# Altium project Mars.PrjPcb
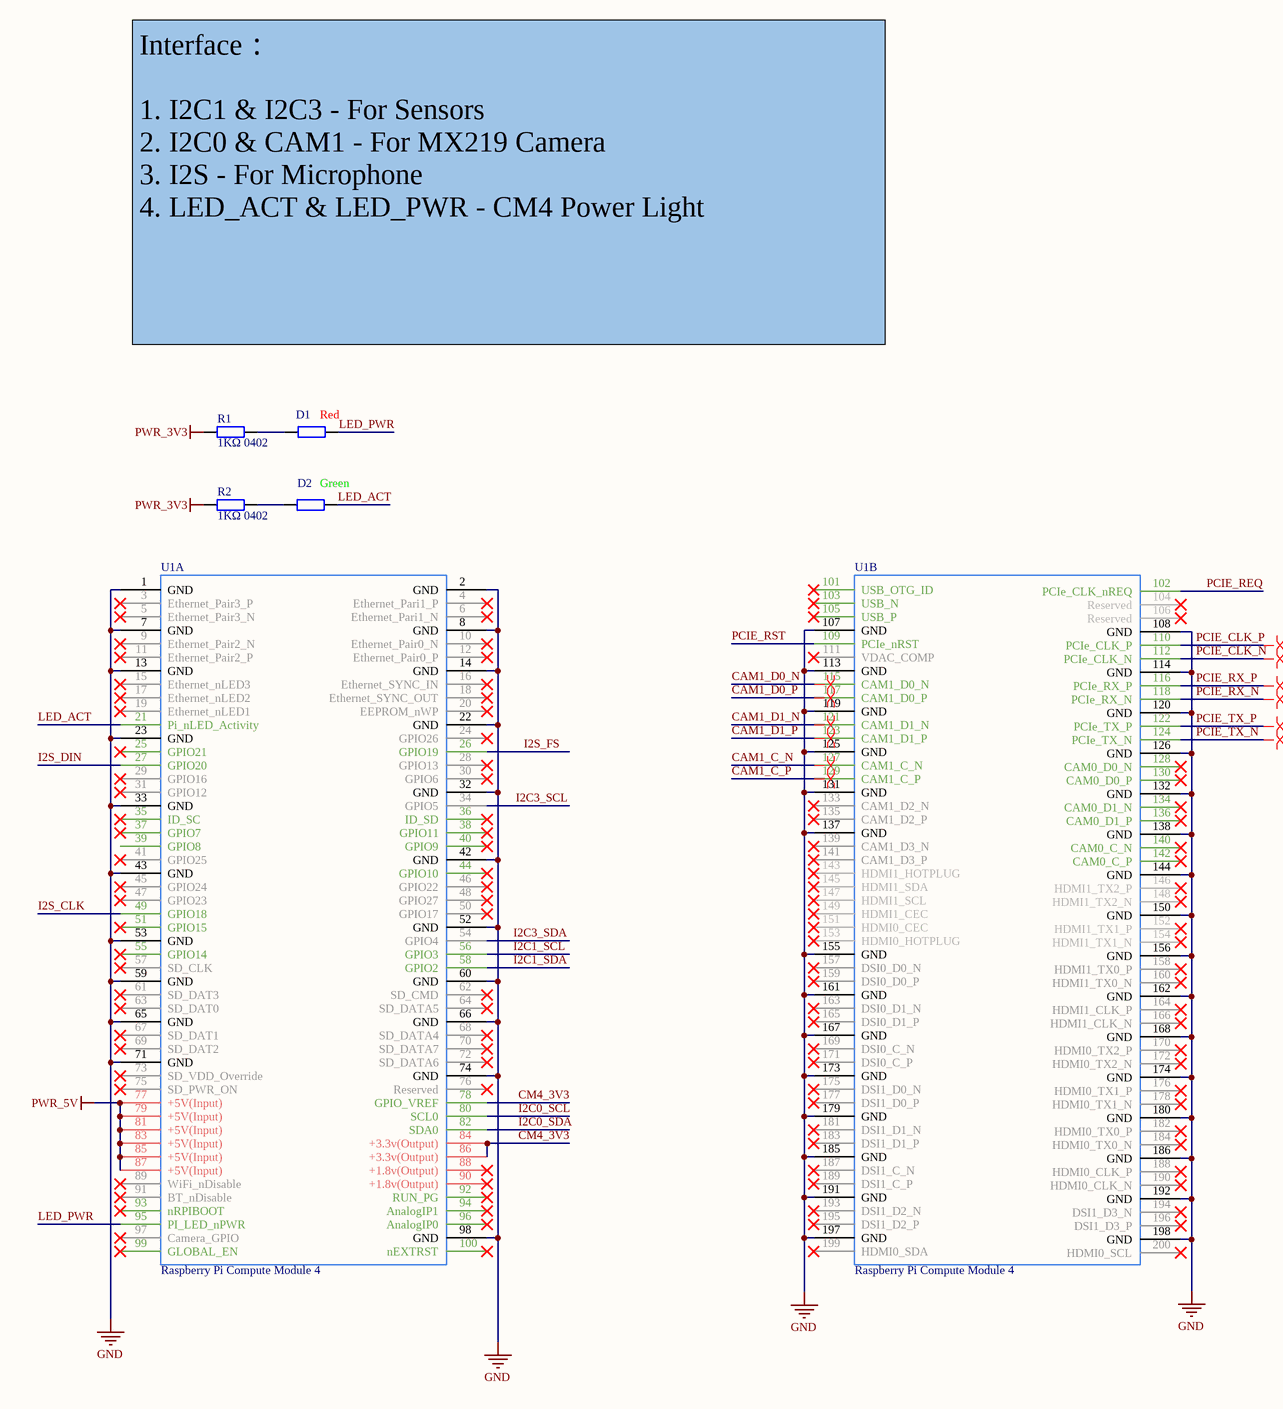
[diagram p0: M1_CM4.SchDoc]
5 sheets, 166 parts. Net scope: global (net labels, ports and power ports of the same name join across sheets).
Board file: M2.PcbDoc
Sheets:
  M1_CM4.SchDoc
  M2_Power.SchDoc
  M3_Coral.SchDoc
  M4_Sensors.SchDoc
  M5_Camera.SchDoc

## Sheet M1_CM4.SchDoc
size A3; SheetNumber: 1; SheetTotal: 5

### Parts
D1  Red  [0402_R]
D2  Green  [0402_R]
R1  1KΩ 0402  [0402_R]
R2  1KΩ 0402  [0402_R]
U1  Raspberry Pi Compute Module 4  [CM4T-DF40HC(3.0)-100DS]  (parts A,B of 2)

### Nets
GND: U1.1(GND) U1.2(GND) U1.7(GND) U1.8(GND) U1.13(GND) U1.14(GND) U1.22(GND) U1.23(GND) U1.32(GND) U1.33(GND) U1.42(GND) U1.43(GND) U1.52(GND) U1.53(GND) U1.59(GND) U1.60(GND) U1.65(GND) U1.66(GND) U1.71(GND) U1.74(GND) U1.98(GND) U1.107(GND) U1.108(GND) U1.113(GND) U1.114(GND) U1.119(GND) U1.120(GND) U1.125(GND) U1.126(GND) U1.131(GND) U1.132(GND) U1.137(GND) U1.138(GND) U1.144(GND) U1.150(GND) U1.155(GND) U1.156(GND) U1.161(GND) U1.162(GND) U1.167(GND) U1.168(GND) U1.173(GND) U1.174(GND) U1.179(GND) U1.180(GND) U1.185(GND) U1.186(GND) U1.191(GND) U1.192(GND) U1.197(GND) U1.198(GND)
PWR_3V3: R1.1 R2.1
PWR_5V: U1.77(+5V(Input)) U1.79(+5V(Input)) U1.81(+5V(Input)) U1.83(+5V(Input)) U1.85(+5V(Input)) U1.87(+5V(Input))
CAM1_C_N: U1.127(CAM1_C_N)
CAM1_C_P: U1.129(CAM1_C_P)
CAM1_D0_N: U1.115(CAM1_D0_N)
CAM1_D0_P: U1.117(CAM1_D0_P)
CAM1_D1_N: U1.121(CAM1_D1_N)
CAM1_D1_P: U1.123(CAM1_D1_P)
CM4_3V3: U1.78(GPIO_VREF) U1.84(+3.3v(Output)) U1.86(+3.3v(Output))
I2C0_SCL: U1.80(SCL0)
I2C0_SDA: U1.82(SDA0)
I2C1_SCL: U1.56(GPIO3)
I2C1_SDA: U1.58(GPIO2)
I2C3_SCL: U1.34(GPIO5)
I2C3_SDA: U1.54(GPIO4)
I2S_CLK: U1.49(GPIO18)
I2S_DIN: U1.27(GPIO20)
I2S_FS: U1.26(GPIO19)
LED_ACT: D2.2 U1.21(Pi_nLED_Activity)
LED_PWR: D1.2 U1.95(PI_LED_nPWR)
PCIE_CLK_N: U1.112(PCIe_CLK_N)
PCIE_CLK_P: U1.110(PCIe_CLK_P)
PCIE_REQ: U1.102(PCIe_CLK_nREQ)
PCIE_RST: U1.109(PCIe_nRST)
PCIE_RX_N: U1.118(PCIe_RX_N)
PCIE_RX_P: U1.116(PCIe_RX_P)
PCIE_TX_N: U1.124(PCIe_TX_N)
PCIE_TX_P: U1.122(PCIe_TX_P)
NetD1_1: D1.1 R1.2
NetD2_1: D2.1 R2.2

Not connected (* = marked no-connect by the designer): U1 3(Ethernet_Pair3_P)* 4(Ethernet_Pari1_P)* 5(Ethernet_Pair3_N)* 6(Ethernet_Pari1_N)* 9(Ethernet_Pair2_N)* 10(Ethernet_Pair0_N)* 11(Ethernet_Pair2_P)* 12(Ethernet_Pair0_P)* 15(Ethernet_nLED3)* 16(Ethernet_SYNC_IN)* 17(Ethernet_nLED2)* 18(Ethernet_SYNC_OUT)* 19(Ethernet_nLED1)* 20(EEPROM_nWP)* 24(GPIO26)* 25(GPIO21)* 28(GPIO13)* 29(GPIO16)* 30(GPIO6)* 31(GPIO12)* 35(ID_SC)* 36(ID_SD)* 37(GPIO7)* 38(GPIO11)* 39(GPIO8) 40(GPIO9)* 41(GPIO25)* 44(GPIO10)* 45(GPIO24)* 46(GPIO22)* 47(GPIO23)* 48(GPIO27)* 50(GPIO17)* 51(GPIO15)* 55(GPIO14)* 57(SD_CLK)* 61(SD_DAT3)* 62(SD_CMD)* 63(SD_DAT0)* 64(SD_DATA5)* 67(SD_DAT1)* 68(SD_DATA4)* 69(SD_DAT2)* 70(SD_DATA7)* 72(SD_DATA6)* 73(SD_VDD_Override)* 75(SD_PWR_ON)* 76(Reserved)* 88(+1.8v(Output))* 89(WiFi_nDisable)* 90(+1.8v(Output))* 91(BT_nDisable)* 92(RUN_PG)* 93(nRPIBOOT)* 94(AnalogIP1)* 96(AnalogIP0)* 97(Camera_GPIO)* 99(GLOBAL_EN)* 100(nEXTRST)* 101(USB_OTG_ID)* 103(USB_N)* 104(Reserved)* 105(USB_P)* 106(Reserved)* 111(VDAC_COMP)* 128(CAM0_D0_N)* 130(CAM0_D0_P)* 133(CAM1_D2_N)* 134(CAM0_D1_N)* 135(CAM1_D2_P)* 136(CAM0_D1_P)* 139(CAM1_D3_N)* 140(CAM0_C_N)* 141(CAM1_D3_P)* 142(CAM0_C_P)* 143(HDMI1_HOTPLUG)* 145(HDMI1_SDA)* 146(HDMI1_TX2_P)* 147(HDMI1_SCL)* 148(HDMI1_TX2_N)* 149(HDMI1_CEC)* 151(HDMI0_CEC)* 152(HDMI1_TX1_P)* 153(HDMI0_HOTPLUG)* 154(HDMI1_TX1_N)* 157(DSI0_D0_N)* 158(HDMI1_TX0_P)* 159(DSI0_D0_P)* 160(HDMI1_TX0_N)* 163(DSI0_D1_N)* 164(HDMI1_CLK_P)* 165(DSI0_D1_P)* 166(HDMI1_CLK_N)* 169(DSI0_C_N)* 170(HDMI0_TX2_P)* 171(DSI0_C_P)* 172(HDMI0_TX2_N)* 175(DSI1_D0_N)* 176(HDMI0_TX1_P)* 177(DSI1_D0_P)* 178(HDMI0_TX1_N)* 181(DSI1_D1_N)* 182(HDMI0_TX0_P)* 183(DSI1_D1_P)* 184(HDMI0_TX0_N)* 187(DSI1_C_N)* 188(HDMI0_CLK_P)* 189(DSI1_C_P)* 190(HDMI0_CLK_N)* 193(DSI1_D2_N)* 194(DSI1_D3_N)* 195(DSI1_D2_P)* 196(DSI1_D3_P)* 199(HDMI0_SDA)* 200(HDMI0_SCL)*

### Layout directives
differential pair: CAM1_C_N, CAM1_C_P, CAM1_D0_N, CAM1_D0_P, CAM1_D1_N, CAM1_D1_P, PCIE_CLK_N, PCIE_CLK_P, PCIE_RX_N, PCIE_RX_P, PCIE_TX_N, PCIE_TX_P

### Notes on the sheet
- Interface：
  1. I2C1 & I2C3 - For Sensors
  2. I2C0 & CAM1 - For MX219 Camera
  3. I2S - For Microphone
  4. LED_ACT & LED_PWR - CM4 Power Light

### Library data of the parts
D1 D2 = 0402 10KΩ (1002) 1%: 贴片电阻; ComponentLink1Description: 供应商链接; ComponentLink1URL: http://www.szlcsc.com/product/details_26487.html; Package: 0402; Supplier: LC; SuppliersPartNumber: C25744
R1 R2 = 0402 1KΩ (1001) 1%: 贴片电阻; ComponentLink1Description: 供应商链接; ComponentLink1URL: http://www.szlcsc.com/product/details_12256.html; Package: 0402; Supplier: LC; SuppliersPartNumber: C11702
U1 = CM4

## Sheet M2_Power.SchDoc
size A3; SheetNumber: 2; SheetTotal: 5
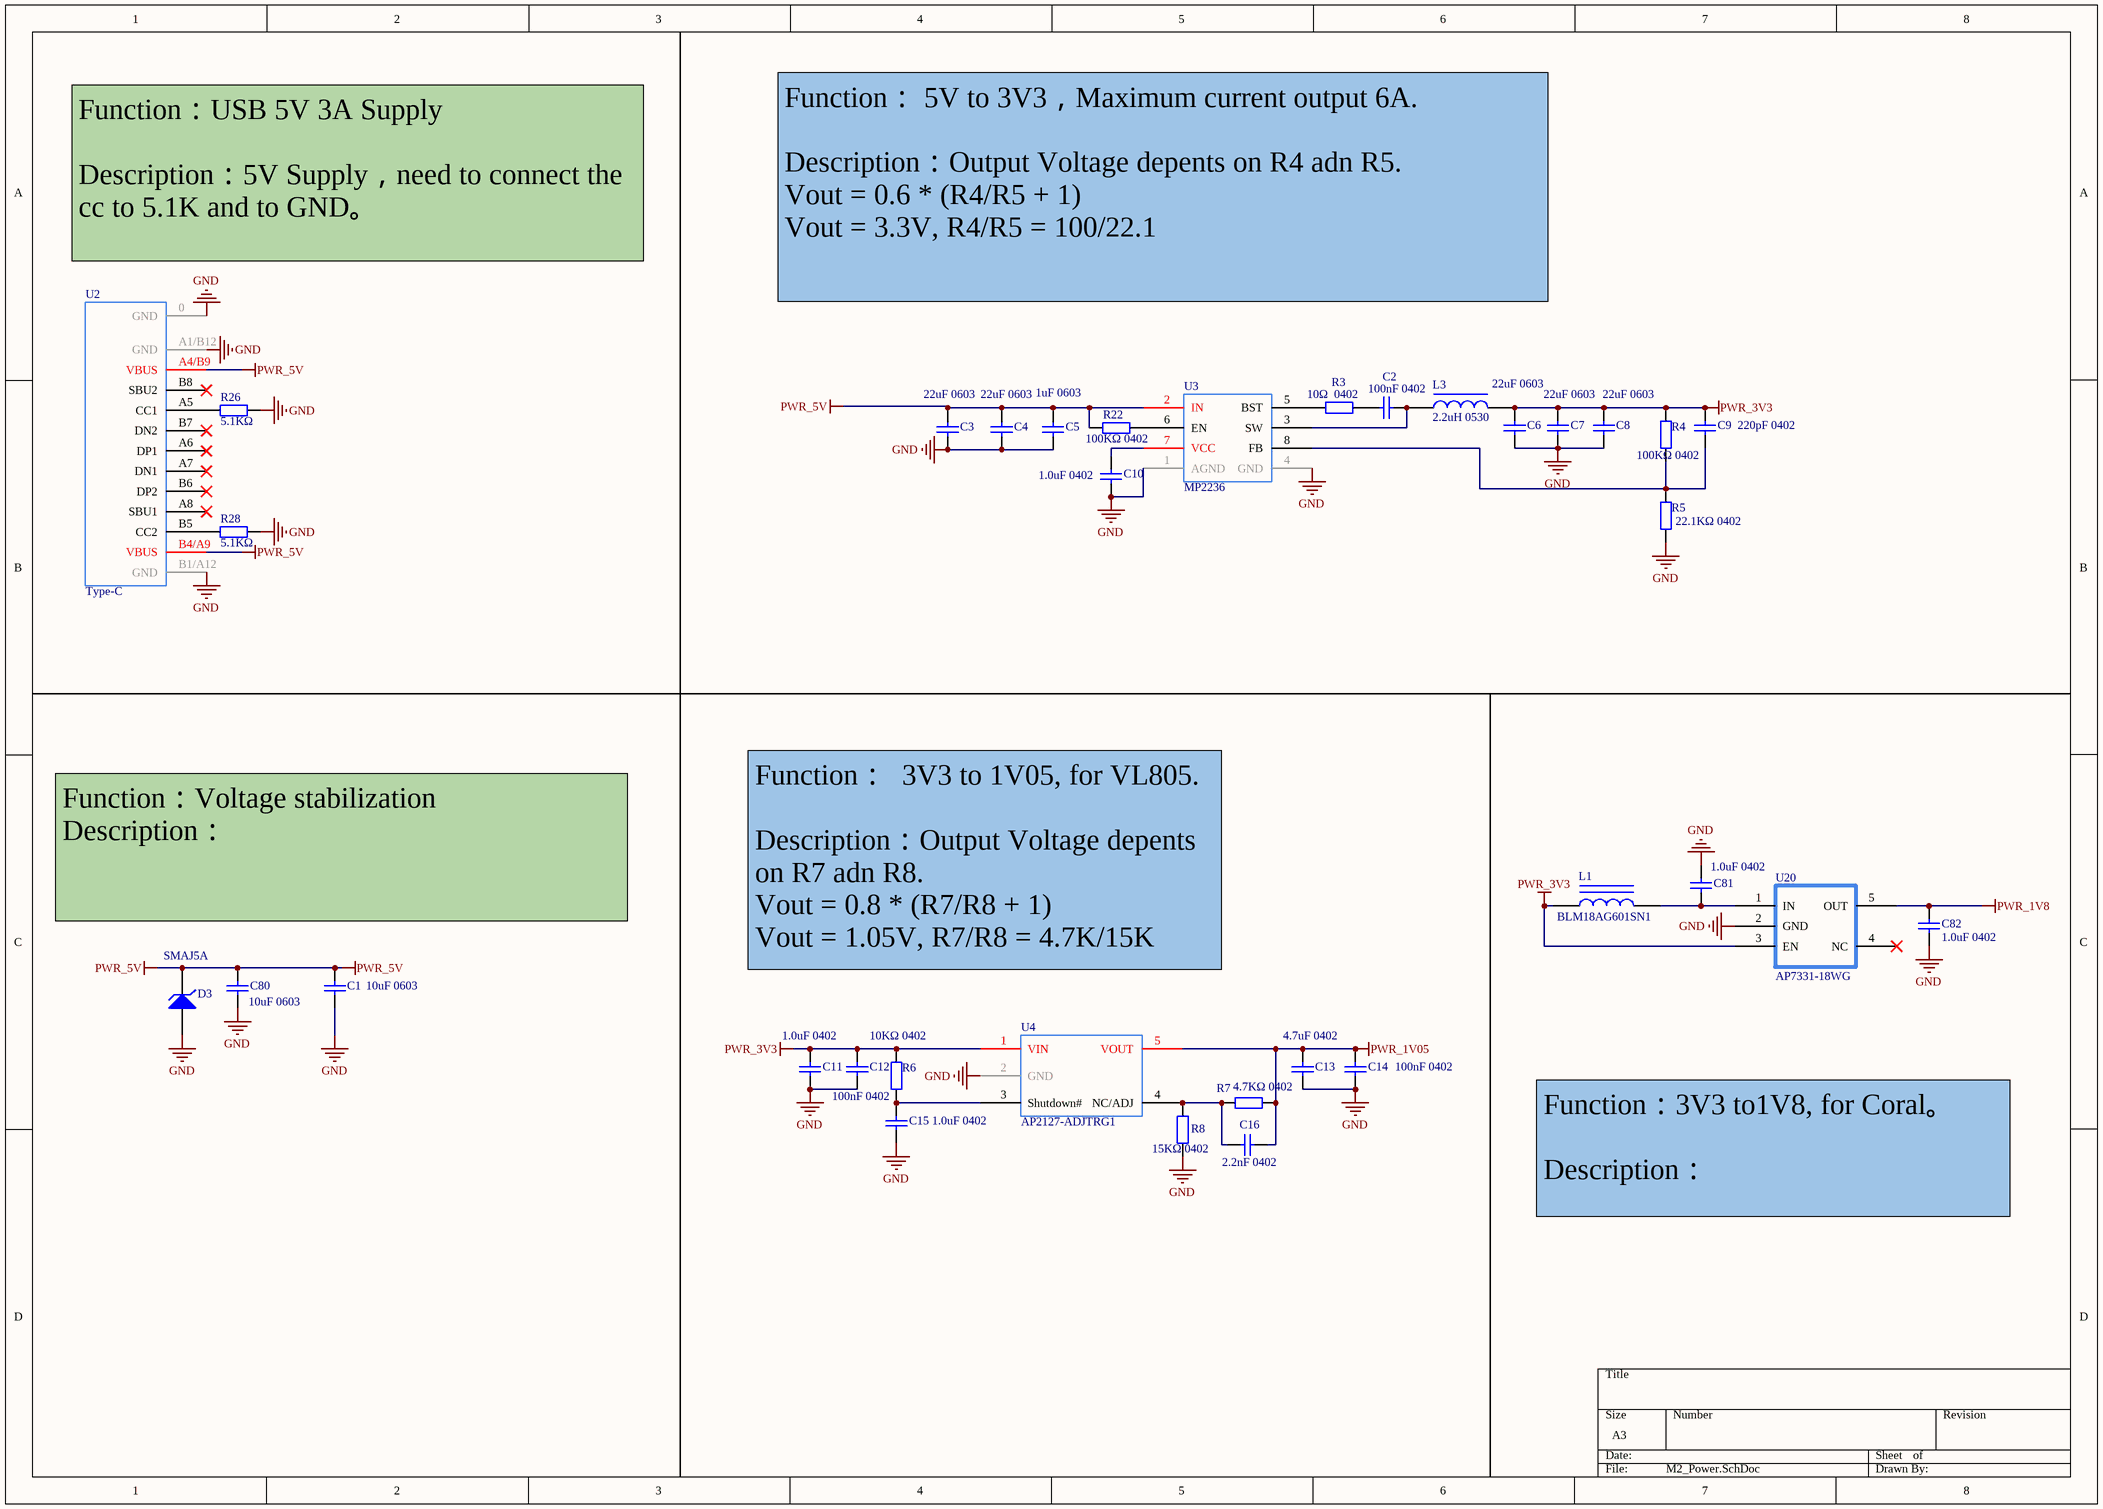
[diagram p1: M2_Power.SchDoc]

### Parts
C1  10uF 0603  [0603_C]
C2  100nF 0402  [0402_C]
C3  22uF 0603  [0603_C]
C4  22uF 0603  [0603_C]
C5  1uF 0603  [0603_C]
C6  22uF 0603  [0603_C]
C7  22uF 0603  [0603_C]
C8  22uF 0603  [0603_C]
C9  220pF 0402  [0402_C]
C10  1.0uF 0402  [0402_C]
C11  1.0uF 0402  [0402_C]
C12  100nF 0402  [0402_C]
C13  4.7uF 0402  [0402_C]
C14  100nF 0402  [0402_C]
C15  1.0uF 0402  [0402_C]
C16  2.2nF 0402  [0402_C]
C80  10uF 0603  [0603_C]
C81  1.0uF 0402  [0402_C]
C82  1.0uF 0402  [0402_C]
D3  SMAJ5A  [SMAJ5A]
L1  BLM18AG601SN1  [0603_L]
L3  2.2uH 0530  [0530]
R3  10Ω  0402  [0402_R]
R4  100KΩ 0402  [0402_R]
R5  22.1KΩ 0402  [0402_R]
R6  10KΩ 0402  [0402_R]
R7  4.7KΩ 0402  [0402_R]
R8  15KΩ 0402  [0402_R]
R22  100KΩ 0402  [0402_R]
R26  5.1KΩ  [0402_R]
R28  5.1KΩ  [0402_R]
U2  Type-C  [Type-C-16P]
U3  MP2236  [MP2236]
U4  AP2127-ADJTRG1  [AP2127K]
U20  AP7331-18WG  [AP7331-18WG]

### Nets
GND: C1.1 C3.1 C4.1 C5.1 C6.1 C7.1 C8.1 C10.1 C11.1 C12.1 C13.1 C14.1 C15.1 C80.1 C81.1 C82.1 D3.1(A) R5.1 R8.1 R26.2 R28.2 U2.0(GND) U2.A1/B12(GND) U2.B1/A12(GND) U3.1(AGND) U3.4(GND) U4.2(GND) U20.2(GND)
PWR_1V05: C13.2 C14.2 C16.2 R7.2 U4.5(VOUT)
PWR_1V8: C82.2 U20.5(OUT)
PWR_3V3: C6.2 C7.2 C8.2 C9.2 C11.2 C12.2 L1.1 L3.2 R4.2 R6.2 U4.1(VIN) U20.3(EN)
PWR_5V: C1.2 C3.2 C4.2 C5.2 C80.2 D3.2(C) R22.1 U2.A4/B9(VBUS) U2.B4/A9(VBUS) U3.2(IN)
NetC2_1: C2.1 R3.2
NetC2_2: C2.2 L3.1 U3.3(SW)
NetC9_1: C9.1 R4.1 R5.2 U3.8(FB)
NetC10_2: C10.2 U3.7(VCC)
NetC15_2: C15.2 R6.1 U4.3(Shutdown#)
NetC16_1: C16.1 R7.1 R8.2 U4.4(NC/ADJ)
NetC81_2: C81.2 L1.2 U20.1(IN)
NetR3_1: R3.1 U3.5(BST)
NetR22_2: R22.2 U3.6(EN)
NetR26_1: R26.1 U2.A5(CC1)
NetR28_1: R28.1 U2.B5(CC2)

Not connected (* = marked no-connect by the designer): U2 A6(DP1)* A7(DN1)* A8(SBU1)* B6(DP2)* B7(DN2)* B8(SBU2)*; U20 4(NC)*

### Notes on the sheet
- Function：USB 5V 3A Supply
  Description：5V Supply，need to connect the cc to 5.1K and to GND。
- Function： 5V to 3V3，Maximum current output 6A.
  Description：Output Voltage depents on R4 adn R5.
  Vout = 0.6 * (R4/R5 + 1)
  Vout = 3.3V, R4/R5 = 100/22.1
- Function：Voltage stabilization
  Description：
- Function：  3V3 to 1V05, for VL805.
  Description：Output Voltage depents on R7 adn R8.
  Vout = 0.8 * (R7/R8 + 1)
  Vout = 1.05V, R7/R8 = 4.7K/15K
- Function：3V3 to1V8, for Coral。
  Description：

### Library data of the parts
C1 C80 = 0603 10uF (106) 10% 10V: 贴片电容; ComponentLink1Description: 供应商链接; ComponentLink1URL: http://www.szlcsc.com/product/details_20411.html; Package: 0603; Supplier: LC; SuppliersPartNumber: C19702
C2 C12 C14 = 0402 100nF (104) 10% 16V: 贴片电容; ComponentLink1Description: 供应商链接; ComponentLink1URL: http://www.szlcsc.com/product/details_1877.html; Package: 0402; Supplier: LC; SuppliersPartNumber: C1525
C3 C4 C6-C8 = 0603 22uF (226) 20% 6.3V: 贴片电容; ComponentLink1Description: 供应商链接; ComponentLink1URL: http://www.szlcsc.com/product/details_60514.html; Package: 0603; Supplier: LC; SuppliersPartNumber: C59461
C5 = 0603 1uF (105) 10% 50V: 贴片电容; ComponentLink1Description: 供应商链接; ComponentLink1URL: http://www.szlcsc.com/product/details_16531.html; Package: 0603; Supplier: LC; SuppliersPartNumber: C15849
C9 = 0402 220pF (221) 10% 50V: 贴片电容; ComponentLink1Description: 供应商链接; ComponentLink1URL: http://www.szlcsc.com/product/details_1882.html; Package: 0402; Supplier: LC; SuppliersPartNumber: C1530
C10 C11 C15 C81 C82 = 0402 1.0uF (105) 10% 25V: 贴片电容; ComponentLink1Description: 供应商链接; ComponentLink1URL: http://www.szlcsc.com/product/details_53938.html; Package: 0402; Supplier: LC; SuppliersPartNumber: C52923
C13 = 0402 4.7uF (475) 20% 10V: 贴片电容; ComponentLink1Description: 供应商链接; ComponentLink1URL: http://www.szlcsc.com/product/details_24469.html; Package: 0402; Supplier: LC; SuppliersPartNumber: C23733
C16 = 0402 2.2nF (222) 10% 50V: 贴片电容; ComponentLink1Description: 供应商链接; ComponentLink1URL: http://www.szlcsc.com/product/details_1883.html; Package: 0402; Supplier: LC; SuppliersPartNumber: C1531
D3 = SMAJ5A: TVS
L1 = 0603 10uH 10%: 贴片电感; ComponentLink1Description: 供应商链接; ComponentLink1URL: http://www.szlcsc.com/product/details_1387.html; Package: 0603; Supplier: LC; SuppliersPartNumber: C1035
L3 = 2.2uH: 2.2uH 0630
R3 = 0402 10Ω (10R0) 1%: 贴片电阻; ComponentLink1Description: 供应商链接; ComponentLink1URL: http://www.szlcsc.com/product/details_25820.html; Package: 0402; Supplier: LC; SuppliersPartNumber: C25077
R4 R22 = 0402 100KΩ (1003) 1%: 贴片电阻; ComponentLink1Description: 供应商链接; ComponentLink1URL: http://www.szlcsc.com/product/details_26484.html; Package: 0402; Supplier: LC; SuppliersPartNumber: C25741
R5 R6 = 0402 10KΩ (1002) 1%: 贴片电阻; ComponentLink1Description: 供应商链接; ComponentLink1URL: http://www.szlcsc.com/product/details_26487.html; Package: 0402; Supplier: LC; SuppliersPartNumber: C25744
R7 = 0402 4.7KΩ (4701) 1%: 贴片电阻; ComponentLink1Description: 供应商链接; ComponentLink1URL: http://www.szlcsc.com/product/details_26643.html; Package: 0402; Supplier: LC; SuppliersPartNumber: C25900
R8 = 0402 15KΩ (1502) 1%: 贴片电阻; ComponentLink1Description: 供应商链接; ComponentLink1URL: http://www.szlcsc.com/product/details_26499.html; Package: 0402; Supplier: LC; SuppliersPartNumber: C25756
R26 R28 = 0402 5.1KΩ (5101) 1%: 贴片电阻; ComponentLink1Description: 供应商链接; ComponentLink1URL: http://www.szlcsc.com/product/details_26648.html; Package: 0402; Supplier: LC; SuppliersPartNumber: C25905
U2 = Type-C-16P
U3 = MP2236: Vin=18, Iout=6A
U4 = AP2127-ADJTRG1: 3.3V-1.05V
U20 = AP7331-18WG: Camera 1.8V

## Sheet M3_Coral.SchDoc
size A3; SheetNumber: 3; SheetTotal: 5
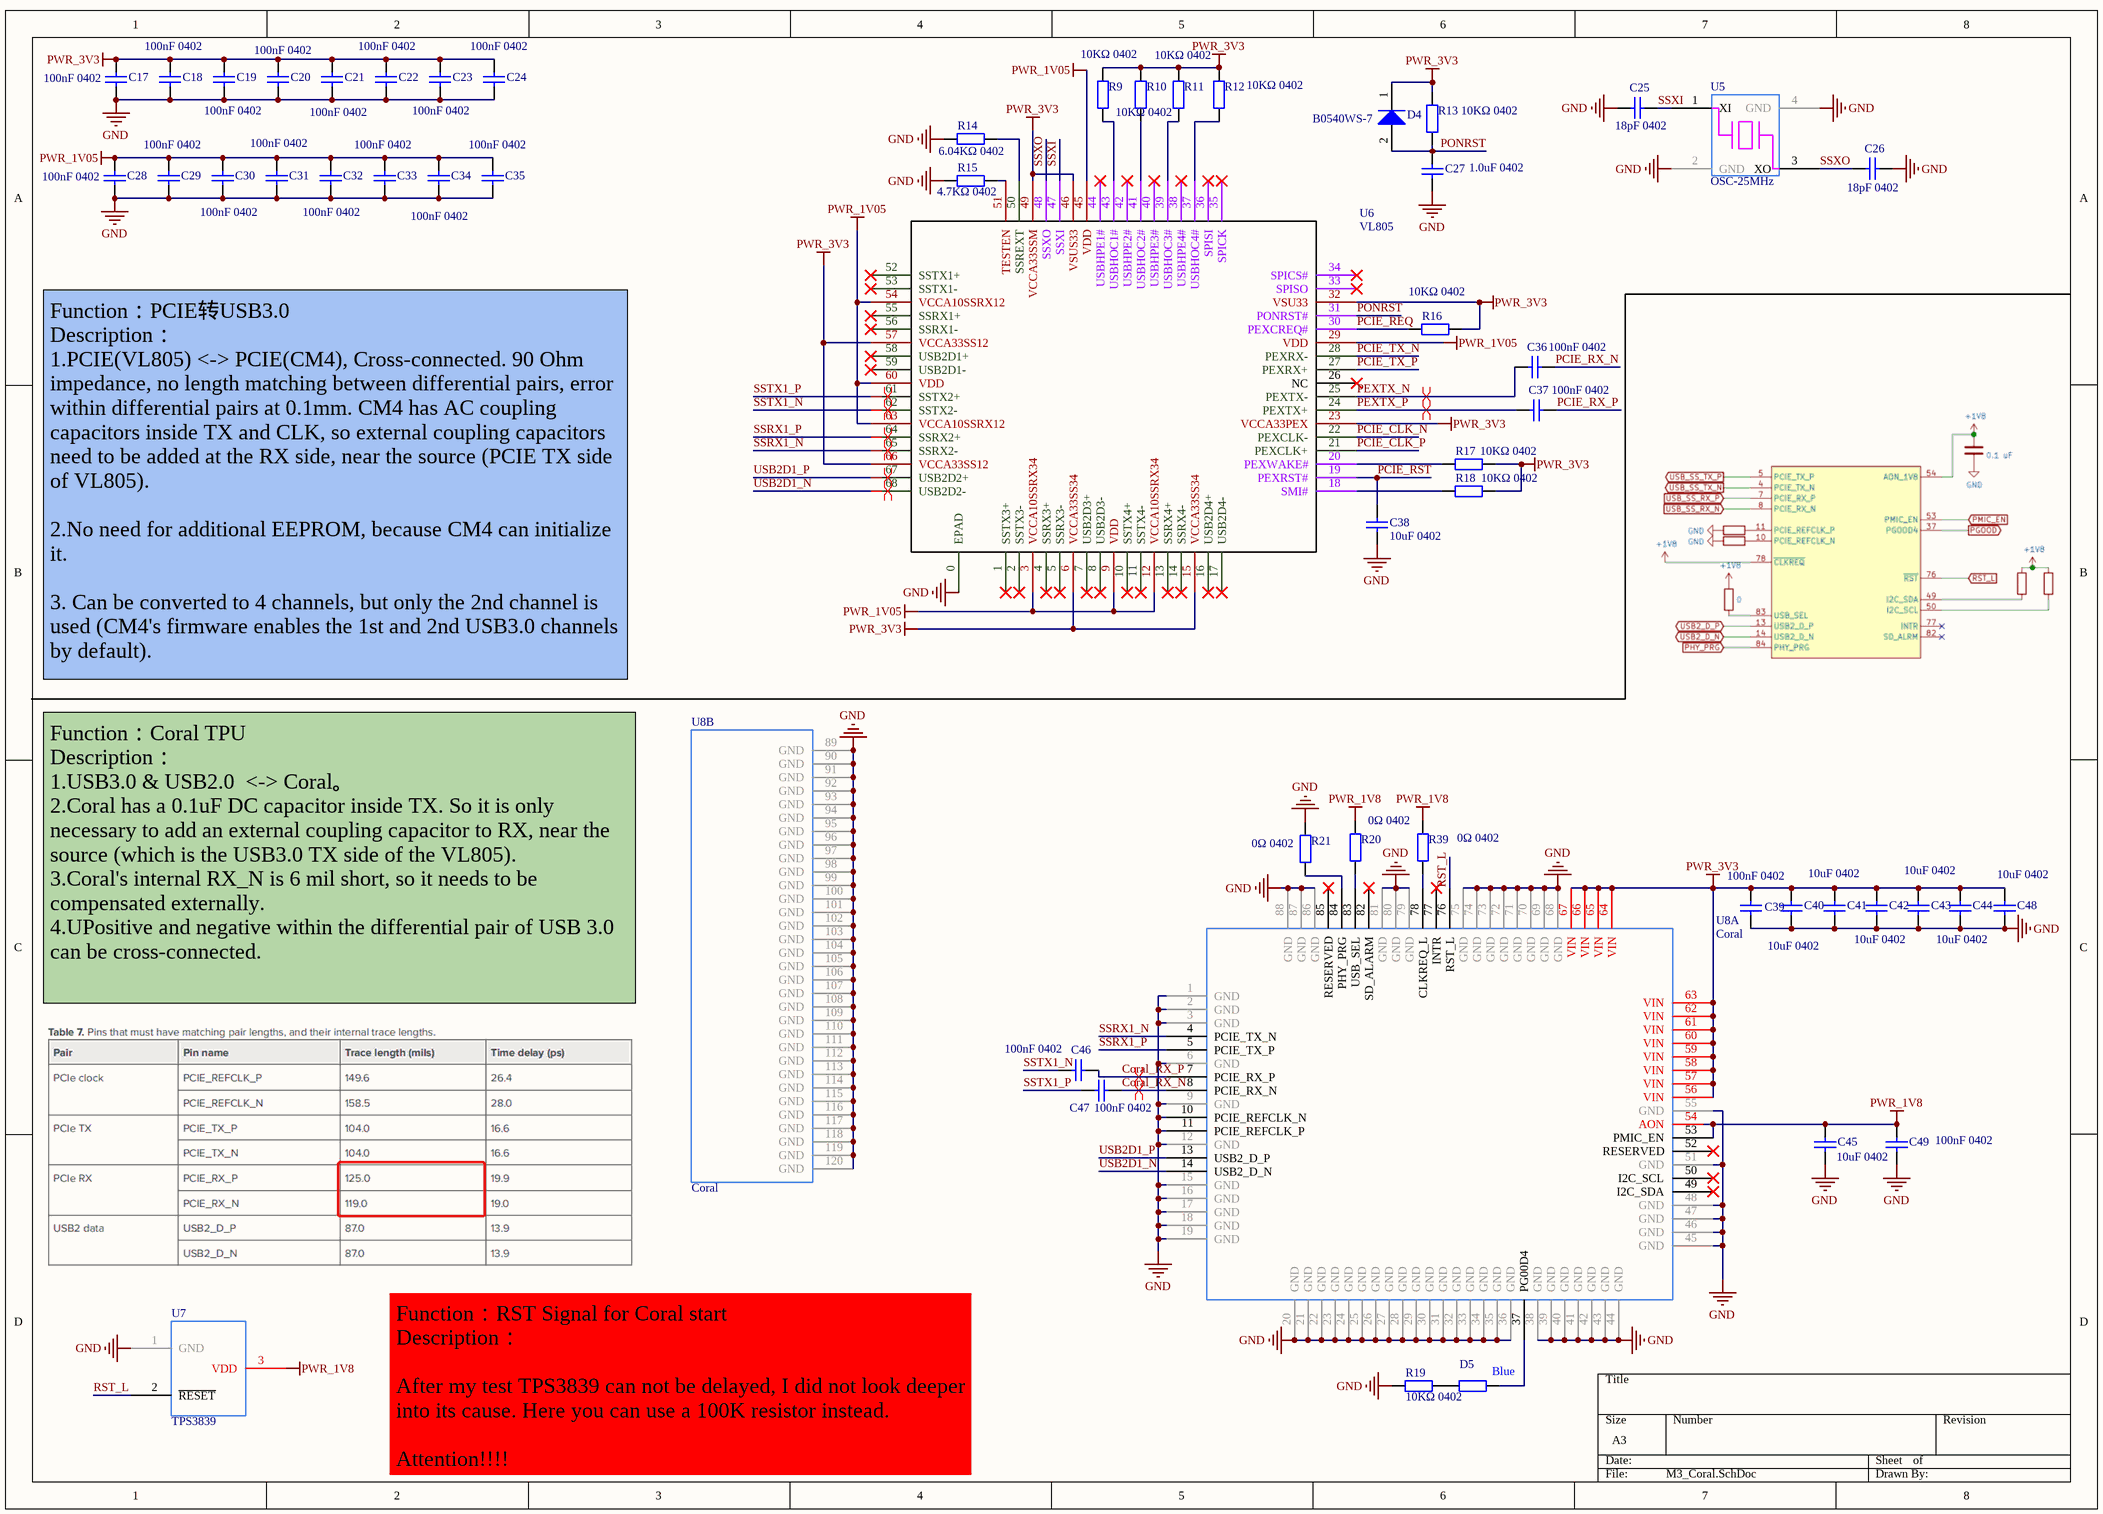
[diagram p2: M3_Coral.SchDoc]

### Parts
C17  100nF 0402  [0402_C]
C18  100nF 0402  [0402_C]
C19  100nF 0402  [0402_C]
C20  100nF 0402  [0402_C]
C21  100nF 0402  [0402_C]
C22  100nF 0402  [0402_C]
C23  100nF 0402  [0402_C]
C24  100nF 0402  [0402_C]
C25  18pF 0402  [0402_C]
C26  18pF 0402  [0402_C]
C27  1.0uF 0402  [0402_C]
C28  100nF 0402  [0402_C]
C29  100nF 0402  [0402_C]
C30  100nF 0402  [0402_C]
C31  100nF 0402  [0402_C]
C32  100nF 0402  [0402_C]
C33  100nF 0402  [0402_C]
C34  100nF 0402  [0402_C]
C35  100nF 0402  [0402_C]
C36  100nF 0402  [0402_C]
C37  100nF 0402  [0402_C]
C38  10uF 0402  [0402_C]
C39  100nF 0402  [0402_C]
C40  10uF 0402  [0402_C]
C41  10uF 0402  [0402_C]
C42  10uF 0402  [0402_C]
C43  10uF 0402  [0402_C]
C44  10uF 0402  [0402_C]
C45  10uF 0402  [0402_C]
C46  100nF 0402  [0402_C]
C47  100nF 0402  [0402_C]
C48  10uF 0402  [0402_C]
C49  100nF 0402  [0402_C]
D4  B0540WS-7  [B0540WS-7]
D5  Blue  [0402_R]
R9  10KΩ 0402  [0402_R]
R10  10KΩ 0402  [0402_R]
R11  10KΩ 0402  [0402_R]
R12  10KΩ 0402  [0402_R]
R13  10KΩ 0402  [0402_R]
R14  6.04KΩ 0402  [0402_R]
R15  4.7KΩ 0402  [0402_R]
R16  10KΩ 0402  [0402_R]
R17  10KΩ 0402  [0402_R]
R18  10KΩ 0402  [0402_R]
R19  10KΩ 0402  [0402_R]
R20  0Ω 0402  [0402_R]
R21  0Ω 0402  [0402_R]
R39  0Ω 0402  [0402_R]
U5  OSC-25MHz  [OSC-25MHz]
U6  VL805  [VL805]
U7  TPS3839  [TPS3839]
U8  Coral  [Coral]  (parts A,B of 2)

### Nets
GND: C17.1 C18.1 C19.1 C20.1 C21.1 C22.1 C23.1 C24.1 C25.1 C26.2 C27.2 C28.1 C29.1 C30.1 C31.1 C32.1 C33.1 C34.1 C35.1 C38.1 C39.1 C40.1 C41.1 C42.1 C43.1 C44.1 C45.1 C48.1 C49.1 R14.2 R15.2 R19.1 R21.2 U5.2(GND) U5.4(GND) U6.0(EPAD) U7.1(GND) U8.1(GND) U8.2(GND) U8.3(GND) U8.6(GND) U8.9(GND) U8.10(PCIE_REFCLK_N) U8.11(PCIE_REFCLK_P) U8.12(GND) U8.15(GND) U8.16(GND) U8.17(GND) U8.18(GND) U8.19(GND) U8.20(GND) U8.21(GND) U8.22(GND) U8.23(GND) U8.24(GND) U8.25(GND) U8.26(GND) U8.27(GND) U8.28(GND) U8.29(GND) U8.30(GND) U8.31(GND) U8.32(GND) U8.33(GND) U8.34(GND) U8.35(GND) U8.36(GND) U8.38(GND) U8.39(GND) U8.40(GND) U8.41(GND) U8.42(GND) U8.43(GND) U8.44(GND) U8.45(GND) U8.46(GND) U8.47(GND) U8.48(GND) U8.51(GND) U8.55(GND) U8.68(GND) U8.69(GND) U8.70(GND) U8.71(GND) U8.72(GND) U8.73(GND) U8.74(GND) U8.75(GND) U8.79(GND) U8.80(GND) U8.81(GND) U8.86(GND) U8.87(GND) U8.88(GND) U8.89(GND) U8.90(GND) U8.91(GND) U8.92(GND) U8.93(GND) U8.94(GND) U8.95(GND) U8.96(GND) U8.97(GND) U8.98(GND) U8.99(GND) U8.100(GND) U8.101(GND) U8.102(GND) U8.103(GND) U8.104(GND) U8.105(GND) U8.106(GND) U8.107(GND) U8.108(GND) U8.109(GND) U8.110(GND) U8.111(GND) U8.112(GND) U8.113(GND) U8.114(GND) U8.115(GND) U8.116(GND) U8.117(GND) U8.118(GND) U8.119(GND) U8.120(GND)
PWR_1V05: C28.2 C29.2 C30.2 C31.2 C32.2 C33.2 C34.2 C35.2 U6.3(VCCA10SSRX34) U6.9(VDD) U6.12(VCCA10SSRX34) U6.29(VDD) U6.45(VDD) U6.54(VCCA10SSRX12) U6.60(VDD) U6.63(VCCA10SSRX12)
PWR_1V8: C45.2 C49.2 R20.2 R39.2 U7.3(VDD) U8.53(PMIC_EN) U8.54(AON)
PWR_3V3: C17.2 C18.2 C19.2 C20.2 C21.2 C22.2 C23.2 C24.2 C39.2 C40.2 C41.2 C42.2 C43.2 C44.2 C48.2 D4.1(K) R9.2 R10.2 R11.2 R12.2 R13.2 R16.2 R17.2 R18.2 U6.6(VCCA33SS34) U6.15(VCCA33SS34) U6.23(VCCA33PEX) U6.32(VSU33) U6.46(VSUS33) U6.49(VCCA33SSM) U6.57(VCCA33SS12) U6.66(VCCA33SS12) U8.56(VIN) U8.57(VIN) U8.58(VIN) U8.59(VIN) U8.60(VIN) U8.61(VIN) U8.62(VIN) U8.63(VIN) U8.64(VIN) U8.65(VIN) U8.66(VIN) U8.67(VIN)
Coral_RX_N: C47.2 U8.8(PCIE_RX_N)
Coral_RX_P: C46.2 U8.7(PCIE_RX_P)
PCIE_CLK_N: U6.22(PEXCLK-)
PCIE_CLK_P: U6.21(PEXCLK+)
PCIE_REQ: R16.1 U6.30(PEXCREQ#)
PCIE_RST: C38.2 U6.19(PEXRST#)
PCIE_RX_N: C36.2
PCIE_RX_P: C37.2
PCIE_TX_N: U6.28(PEXRX-)
PCIE_TX_P: U6.27(PEXRX+)
PEXTX_N: C36.1 U6.25(PEXTX-)
PEXTX_P: C37.1 U6.24(PEXTX+)
PONRST: C27.1 D4.2(A) R13.1 U6.31(PONRST#)
RST_L: U7.2(~{RESET}) U8.76(RST_L)
SSRX1_N: U6.65(SSRX2-) U8.4(PCIE_TX_N)
SSRX1_P: U6.64(SSRX2+) U8.5(PCIE_TX_P)
SSTX1_N: C46.1 U6.62(SSTX2-)
SSTX1_P: C47.1 U6.61(SSTX2+)
SSXI: C25.2 U5.1(XI) U6.47(SSXI)
SSXO: C26.1 U5.3(XO) U6.48(SSXO)
USB2D1_N: U6.68(USB2D2-) U8.14(USB2_D_N)
USB2D1_P: U6.67(USB2D2+) U8.13(USB2_D_P)
NetD5_1: D5.1 R19.2
NetD5_2: D5.2 U8.37(PG00D4)
NetR9_1: R9.1 U6.43(USBHOC1#)
NetR10_1: R10.1 U6.41(USBHOC2#)
NetR11_1: R11.1 U6.39(USBHOC3#)
NetR12_1: R12.1 U6.37(USBHOC4#)
NetR14_1: R14.1 U6.50(SSREXT)
NetR15_1: R15.1 U6.51(TESTEN)
NetR17_1: R17.1 U6.20(PEXWAKE#)
NetR18_1: R18.1 U6.18(SMI#)
NetR20_1: R20.1 U8.83(USB_SEL)
NetR21_1: R21.1 U8.84(PHY_PRG)
NetR39_1: R39.1 U8.78(CLKREQ_L)

Not connected (* = marked no-connect by the designer): U6 1(SSTX3+)* 2(SSTX3-)* 4(SSRX3+)* 5(SSRX3-)* 7(USB2D3+)* 8(USB2D3-)* 10(SSTX4+)* 11(SSTX4-)* 13(SSRX4+)* 14(SSRX4-)* 16(USB2D4+)* 17(USB2D4-)* 26(NC)* 33(SPISO)* 34(SPICS#)* 35(SPICK)* 36(SPISI)* 38(USBHPE4#)* 40(USBHPE3#)* 42(USBHPE2#)* 44(USBHPE1#)* 52(SSTX1+)* 53(SSTX1-)* 55(SSRX1+)* 56(SSRX1-)* 58(USB2D1+)* 59(USB2D1-)*; U8 49(I2C_SDA)* 50(I2C_SCL)* 52(RESERVED)* 77(INTR)* 82(SD_ALARM)* 85(RESERVED)*

### Layout directives
differential pair: Coral_RX_N, Coral_RX_P, PEXTX_N, PEXTX_P, SSRX1_N, SSRX1_P, SSTX1_N, SSTX1_P, USB2D1_N, USB2D1_P

### Notes on the sheet
- Function：PCIE转USB3.0
  Description：
  1.PCIE(VL805) <-> PCIE(CM4), Cross-connected. 90 Ohm impedance, no length matching between differential pairs, error within differential pairs at 0.1mm. CM4 has AC coupling capacitors inside TX and CLK, so external coupling capacitors need to be added at the RX side, near the source (PCIE TX side of VL805).
  2.No need for additional EEPROM, because CM4 can initialize it.
  3. Can be converted to 4 channels, but only the 2nd channel is used (CM4's firmware enables the 1st and 2nd USB3.0 channels by default).
- Function：Coral TPU
  Description：
  1.USB3.0 & USB2.0  <-> Coral。
  2.Coral has a 0.1uF DC capacitor inside TX. So it is only necessary to add an external coupling capacitor to RX, near the source (which is the USB3.0 TX side of the VL805).
  3.Coral's internal RX_N is 6 mil short, so it needs to be compensated externally.
  4.UPositive and negative within the differential pair of USB 3.0 can be cross-connected.
- Function：RST Signal for Coral start
  Description：
  After my test TPS3839 can not be delayed, I did not look deeper into its cause. Here you can use a 100K resistor instead.
  Attention!!!!

### Library data of the parts
C17-C24 C28-C37 C39 C46 C47 C49 = 0402 100nF (104) 10% 16V: 贴片电容; ComponentLink1Description: 供应商链接; ComponentLink1URL: http://www.szlcsc.com/product/details_1877.html; Package: 0402; Supplier: LC; SuppliersPartNumber: C1525
C25 C26 = 0402 18pF (180) 5% 50V: 贴片电容; ComponentLink1Description: 供应商链接; ComponentLink1URL: http://www.szlcsc.com/product/details_1901.html; Package: 0402; Supplier: LC; SuppliersPartNumber: C1549
C27 = 0402 1.0uF (105) 10% 25V: 贴片电容; ComponentLink1Description: 供应商链接; ComponentLink1URL: http://www.szlcsc.com/product/details_53938.html; Package: 0402; Supplier: LC; SuppliersPartNumber: C52923
C38 C40-C45 C48 = 0402 10uF (106) 20% 6.3V: 贴片电容; ComponentLink1Description: 供应商链接; ComponentLink1URL: http://www.szlcsc.com/product/details_16204.html; Package: 0402; Supplier: LC; SuppliersPartNumber: C15525
D5 R9-R13 R16-R19 = 0402 10KΩ (1002) 1%: 贴片电阻; ComponentLink1Description: 供应商链接; ComponentLink1URL: http://www.szlcsc.com/product/details_26487.html; Package: 0402; Supplier: LC; SuppliersPartNumber: C25744
R14 = 0402 5.6KΩ (5601) 1%: 贴片电阻; ComponentLink1Description: 供应商链接; ComponentLink1URL: http://www.szlcsc.com/product/details_26651.html; Package: 0402; Supplier: LC; SuppliersPartNumber: C25908
R15 = 0402 4.7KΩ (4701) 1%: 贴片电阻; ComponentLink1Description: 供应商链接; ComponentLink1URL: http://www.szlcsc.com/product/details_26643.html; Package: 0402; Supplier: LC; SuppliersPartNumber: C25900
R20 R21 R39 = 0402 0Ω (0R0) 1%: 贴片电阻; ComponentLink1Description: 供应商链接; ComponentLink1URL: http://www.szlcsc.com/product/details_17853.html; Package: 0402; Supplier: LC; SuppliersPartNumber: C17168
U5 = OSC-25MHz: Passive crystal oscillator
U6 = VL805: PCIe to USB3.0
U7 = TPS3839: Delay 200 MS
U8 = Coral: G313-06329-00

## Sheet M4_Sensors.SchDoc
size A3; SheetNumber: 4; SheetTotal: 5
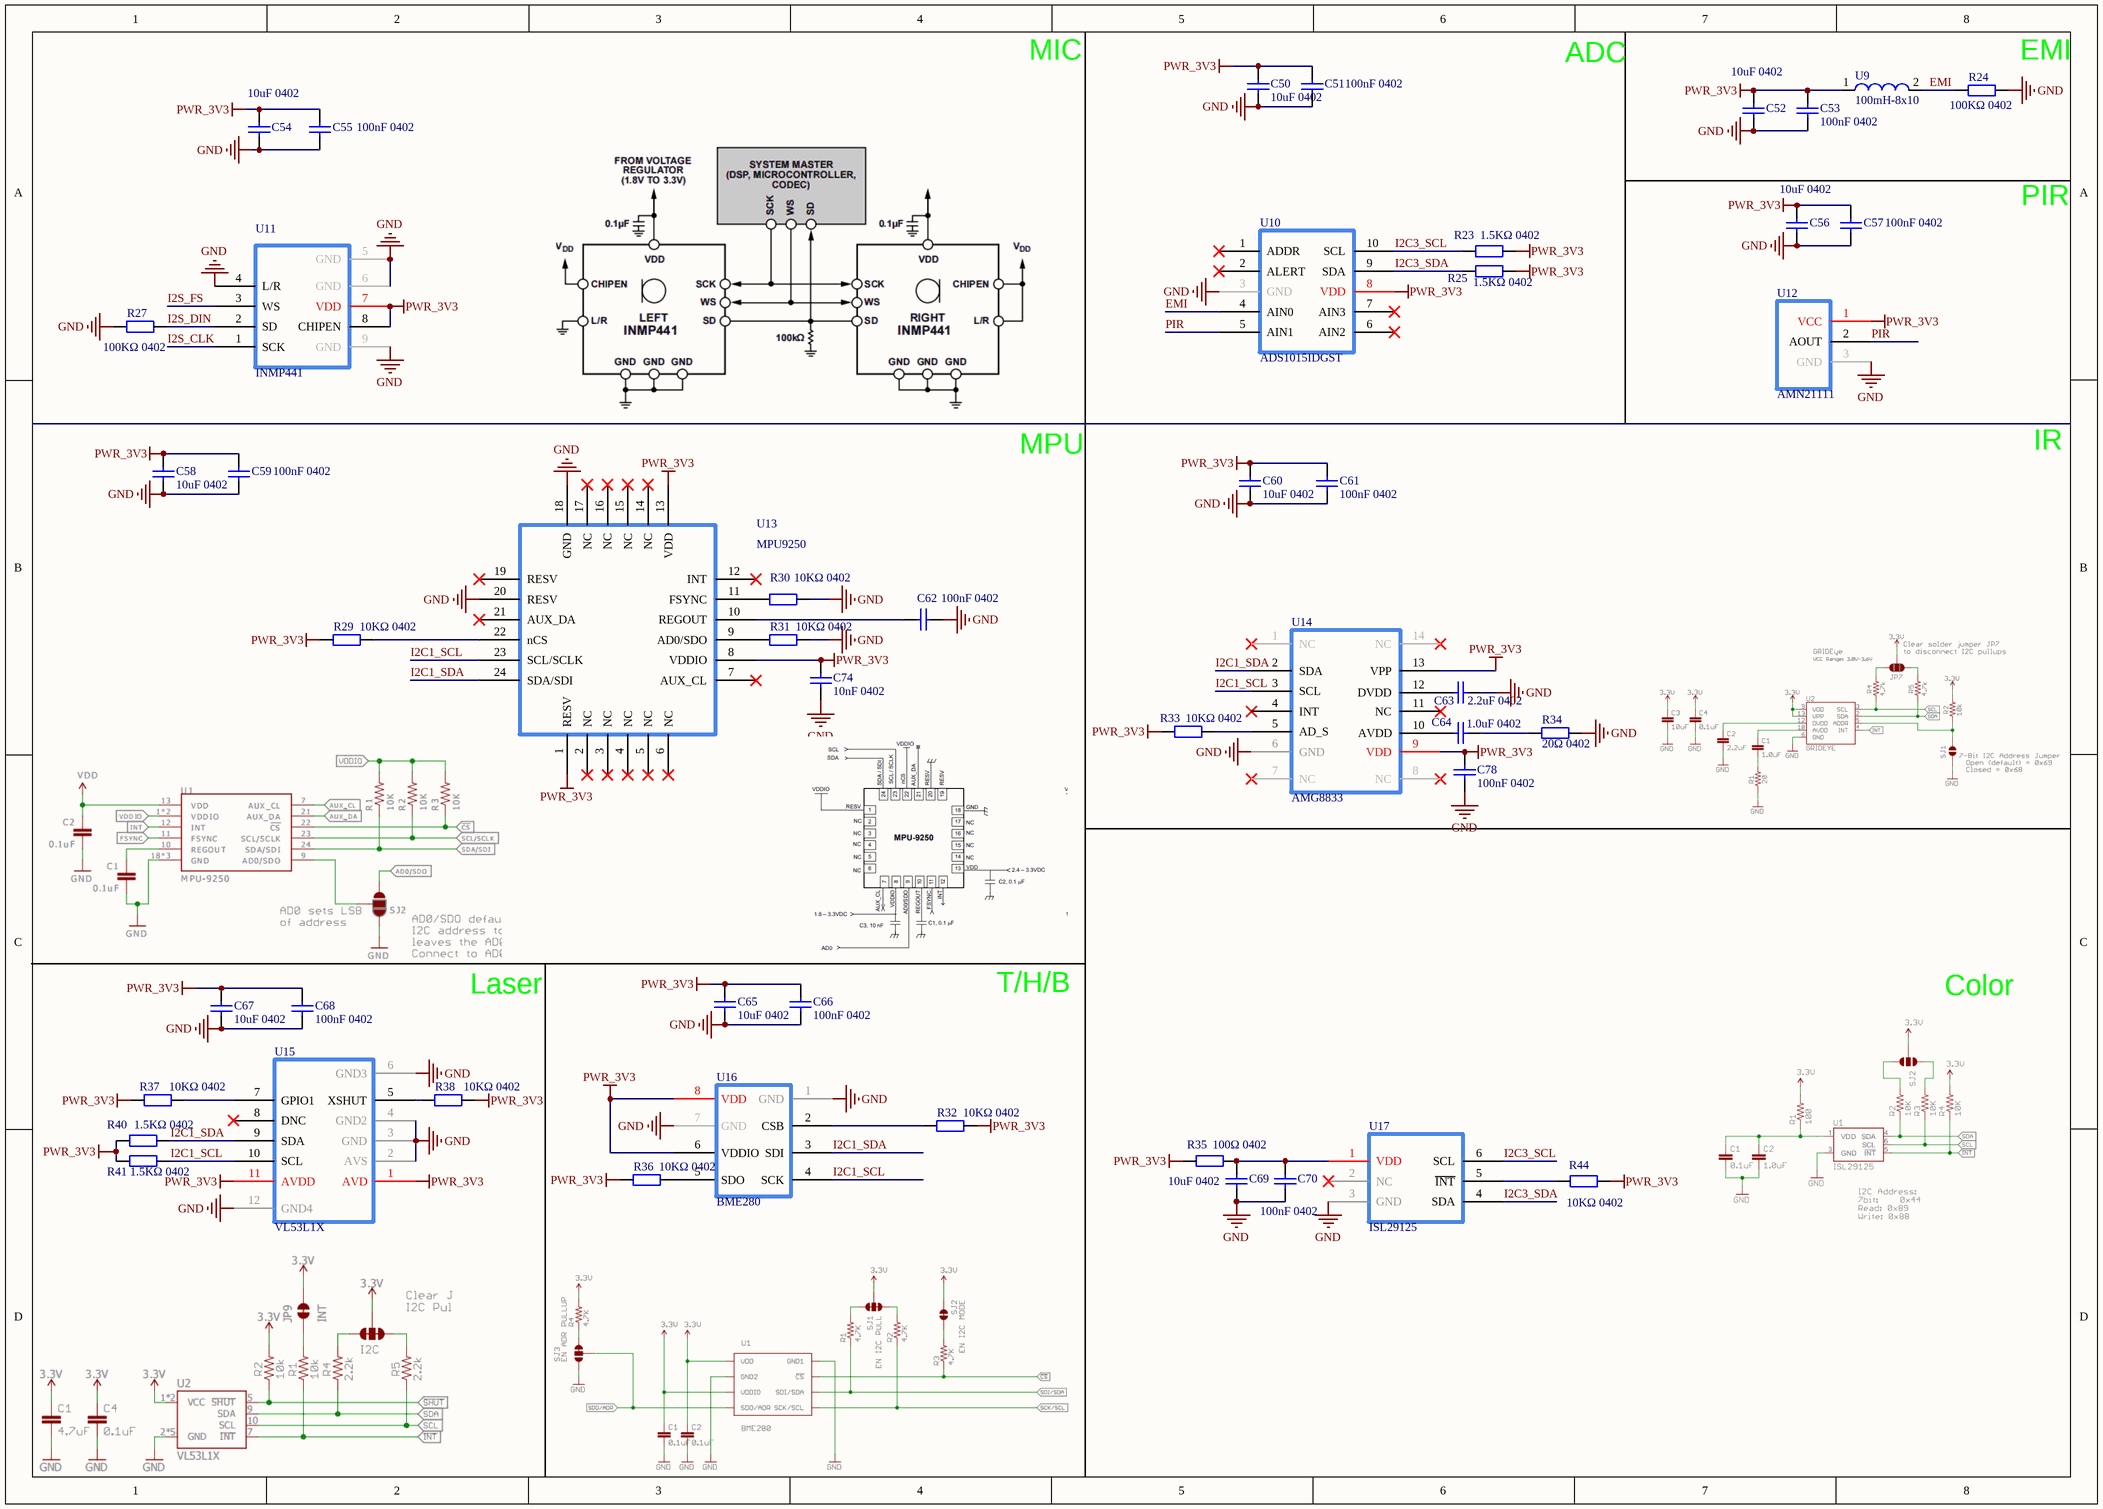
[diagram p3: M4_Sensors.SchDoc]

### Parts
C50  10uF 0402  [0402_C]
C51  100nF 0402  [0402_C]
C52  10uF 0402  [0402_C]
C53  100nF 0402  [0402_C]
C54  10uF 0402  [0402_C]
C55  100nF 0402  [0402_C]
C56  10uF 0402  [0402_C]
C57  100nF 0402  [0402_C]
C58  10uF 0402  [0402_C]
C59  100nF 0402  [0402_C]
C60  10uF 0402  [0402_C]
C61  100nF 0402  [0402_C]
C62  100nF 0402  [0402_C]
C63  2.2uF 0402  [0402_C]
C64  1.0uF 0402  [0402_C]
C65  10uF 0402  [0402_C]
C66  100nF 0402  [0402_C]
C67  10uF 0402  [0402_C]
C68  100nF 0402  [0402_C]
C69  10uF 0402  [0402_C]
C70  100nF 0402  [0402_C]
C74  10nF 0402  [0402_C]
C78  100nF 0402  [0402_C]
R23  1.5KΩ 0402  [0402_R]
R24  100KΩ 0402  [0402_R]
R25  1.5KΩ 0402  [0402_R]
R27  100KΩ 0402  [0402_R]
R29  10KΩ 0402  [0402_R]
R30  10KΩ 0402  [0402_R]
R31  10KΩ 0402  [0402_R]
R32  10KΩ 0402  [0402_R]
R33  10KΩ 0402  [0402_R]
R34  20Ω 0402  [0402_R]
R35  100Ω 0402  [0402_R]
R36  10KΩ 0402  [0402_R]
R37  10KΩ 0402  [0402_R]
R38  10KΩ 0402  [0402_R]
R40  1.5KΩ 0402  [0402_R]
R41  1.5KΩ 0402  [0402_R]
R44  10KΩ 0402  [0402_R]
U9  100mH-8x10  [100mH-8x10]
U10  ADS1015IDGST  [ADS1015]
U11  INMP441  [INMP441]
U12  AMN21111  [AMN21111]
U13  MPU9250  [MPU9250]
U14  AMG8833  [AMG8833]
U15  VL53L1X  [VL53L1X]
U16  BME280  [BME280]
U17  ISL29125  [ISL29125]

### Nets
GND: C50.1 C51.1 C52.1 C53.1 C54.1 C55.1 C56.1 C57.1 C58.2 C59.2 C60.2 C61.2 C62.2 C63.2 C65.2 C66.2 C67.1 C68.1 C69.2 C70.2 C74.1 C78.2 R24.2 R27.2 R30.2 R31.2 R34.2 U10.3(GND) U11.4(L/R) U11.5(GND) U11.6(GND) U11.9(GND) U12.3(GND) U13.18(GND) U13.20(RESV) U14.6(GND) U15.2(AVS) U15.3(GND) U15.4(GND2) U15.6(GND3) U15.12(GND4) U16.1(GND) U16.7(GND) U17.3(GND)
PWR_3V3: C50.2 C51.2 C52.2 C53.2 C54.2 C55.2 C56.2 C57.2 C58.1 C59.1 C60.1 C61.1 C65.1 C66.1 C67.2 C68.2 C74.2 C78.1 R23.2 R25.2 R29.1 R32.2 R33.1 R35.1 R36.1 R37.1 R38.2 R40.1 R41.1 R44.2 U9.1 U10.8(VDD) U11.7(VDD) U11.8(CHIPEN) U12.1(VCC) U13.1(RESV) U13.8(VDDIO) U13.13(VDD) U14.9(VDD) U14.13(VPP) U15.1(AVD) U15.11(AVDD) U16.6(VDDIO) U16.8(VDD)
EMI: R24.1 U9.2 U10.4(AIN0)
I2C1_SCL: R41.2 U13.23(SCL/SCLK) U14.3(SCL) U15.10(SCL) U16.4(SCK)
I2C1_SDA: R40.2 U13.24(SDA/SDI) U14.2(SDA) U15.9(SDA) U16.3(SDI)
I2C3_SCL: R23.1 U10.10(SCL) U17.6(SCL)
I2C3_SDA: R25.1 U10.9(SDA) U17.4(SDA)
I2S_CLK: U11.1(SCK)
I2S_DIN: R27.1 U11.2(SD)
I2S_FS: U11.3(WS)
PIR: U10.5(AIN1) U12.2(AOUT)
NetC62_1: C62.1 U13.10(REGOUT)
NetC63_1: C63.1 U14.12(DVDD)
NetC64_1: C64.1 U14.10(AVDD)
NetC64_2: C64.2 R34.1
NetC69_1: C69.1 C70.1 R35.2 U17.1(VDD)
NetR29_2: R29.2 U13.22(nCS)
NetR30_1: R30.1 U13.11(FSYNC)
NetR31_1: R31.1 U13.9(AD0/SDO)
NetR32_1: R32.1 U16.2(CSB)
NetR33_2: R33.2 U14.5(AD_S)
NetR36_2: R36.2 U16.5(SDO)
NetR37_2: R37.2 U15.7(GPIO1)
NetR38_1: R38.1 U15.5(XSHUT)
NetR44_1: R44.1 U17.5(~{INT})

Not connected (* = marked no-connect by the designer): U10 1(ADDR)* 2(ALERT)* 6(AIN2)* 7(AIN3)*; U13 2(NC)* 3(NC)* 4(NC)* 5(NC)* 6(NC)* 7(AUX_CL)* 12(INT)* 14(NC)* 15(NC)* 16(NC)* 17(NC)* 19(RESV)* 21(AUX_DA)*; U14 1(NC)* 4(INT)* 7(NC)* 8(NC)* 11(NC)* 14(NC)*; U15 8(DNC)*; U17 2(NC)*

### Notes on the sheet
- MIC
- ADC
- (near R24) EMI
- PIR
- IR
- MPU
- Laser
- T/H/B
- Color

### Library data of the parts
C50 C52 C54 C56 C58 C60 C65 C67 C69 = 0402 10uF (106) 20% 6.3V: 贴片电容; ComponentLink1Description: 供应商链接; ComponentLink1URL: http://www.szlcsc.com/product/details_16204.html; Package: 0402; Supplier: LC; SuppliersPartNumber: C15525
C51 C53 C55 C57 C59 C61 C62 C66 C68 C70 C78 = 0402 100nF (104) 10% 16V: 贴片电容; ComponentLink1Description: 供应商链接; ComponentLink1URL: http://www.szlcsc.com/product/details_1877.html; Package: 0402; Supplier: LC; SuppliersPartNumber: C1525
C63 = 0402 4.7uF (475) 20% 10V: 贴片电容; ComponentLink1Description: 供应商链接; ComponentLink1URL: http://www.szlcsc.com/product/details_24469.html; Package: 0402; Supplier: LC; SuppliersPartNumber: C23733
C64 = 0402 1.0uF (105) 10% 25V: 贴片电容; ComponentLink1Description: 供应商链接; ComponentLink1URL: http://www.szlcsc.com/product/details_53938.html; Package: 0402; Supplier: LC; SuppliersPartNumber: C52923
C74 = 0402 10nF (103) 10% 50V: 贴片电容; ComponentLink1Description: 供应商链接; ComponentLink1URL: http://www.szlcsc.com/product/details_15869.html; Package: 0402; Supplier: LC; SuppliersPartNumber: C15195
R23 R25 R40 R41 = 0402 1.5KΩ (1501) 1%: 贴片电阻; ComponentLink1Description: 供应商链接; ComponentLink1URL: http://www.szlcsc.com/product/details_26610.html; Package: 0402; Supplier: LC; SuppliersPartNumber: C25867
R24 R27 = 0402 100KΩ (1003) 1%: 贴片电阻; ComponentLink1Description: 供应商链接; ComponentLink1URL: http://www.szlcsc.com/product/details_26484.html; Package: 0402; Supplier: LC; SuppliersPartNumber: C25741
R29-R33 R36-R38 R44 = 0402 10KΩ (1002) 1%: 贴片电阻; ComponentLink1Description: 供应商链接; ComponentLink1URL: http://www.szlcsc.com/product/details_26487.html; Package: 0402; Supplier: LC; SuppliersPartNumber: C25744
R34 = 0402 22Ω (22R0) 1%: 贴片电阻; ComponentLink1Description: 供应商链接; ComponentLink1URL: http://www.szlcsc.com/product/details_25835.html; Package: 0402; Supplier: LC; SuppliersPartNumber: C25092
R35 = 0402 100Ω (1000) 1%: 贴片电阻; ComponentLink1Description: 供应商链接; ComponentLink1URL: http://www.szlcsc.com/product/details_25819.html; Package: 0402; Supplier: LC; SuppliersPartNumber: C25076
U9 = 100mH-8x10: Sensor 100mH
U10 = ADS1015IDGST: ADC 12Bit 4Channel; MF: Texas Instruments; Mouser-Purchase-URL: https://snapeda.com/shop?store=Mouser&id=425936; Price: None; Availability: Good; Package: VSSOP-10 Texas Instruments; DigiKey-Purchase-URL: https://snapeda.com/shop?store=DigiKey&id=425936; MP: ADS1015IDGST; Value: *; SnapEDA_Link: https://www.snapeda.com/parts/ADS1015IDGST/Texas%20Instruments/view-part/425936/?ref=snap; Texas_Instruments-Purchase-URL: https://snapeda.com/shop?store=Texas+Instruments&id=425936
U11 = INMP441: Sensor Microphone
U12 = AMN21111: Sensor PIR
U13 = MPU9250: Sensor MPU
U14 = AMG8833: Sensor IR
U15 = VL53L1X: Sensor Laser
U16 = BME280: Sensor T/H/B TOP View
U17 = ISL29125: Sensor Color

## Sheet M5_Camera.SchDoc
size A; SheetNumber: 5; SheetTotal: 5
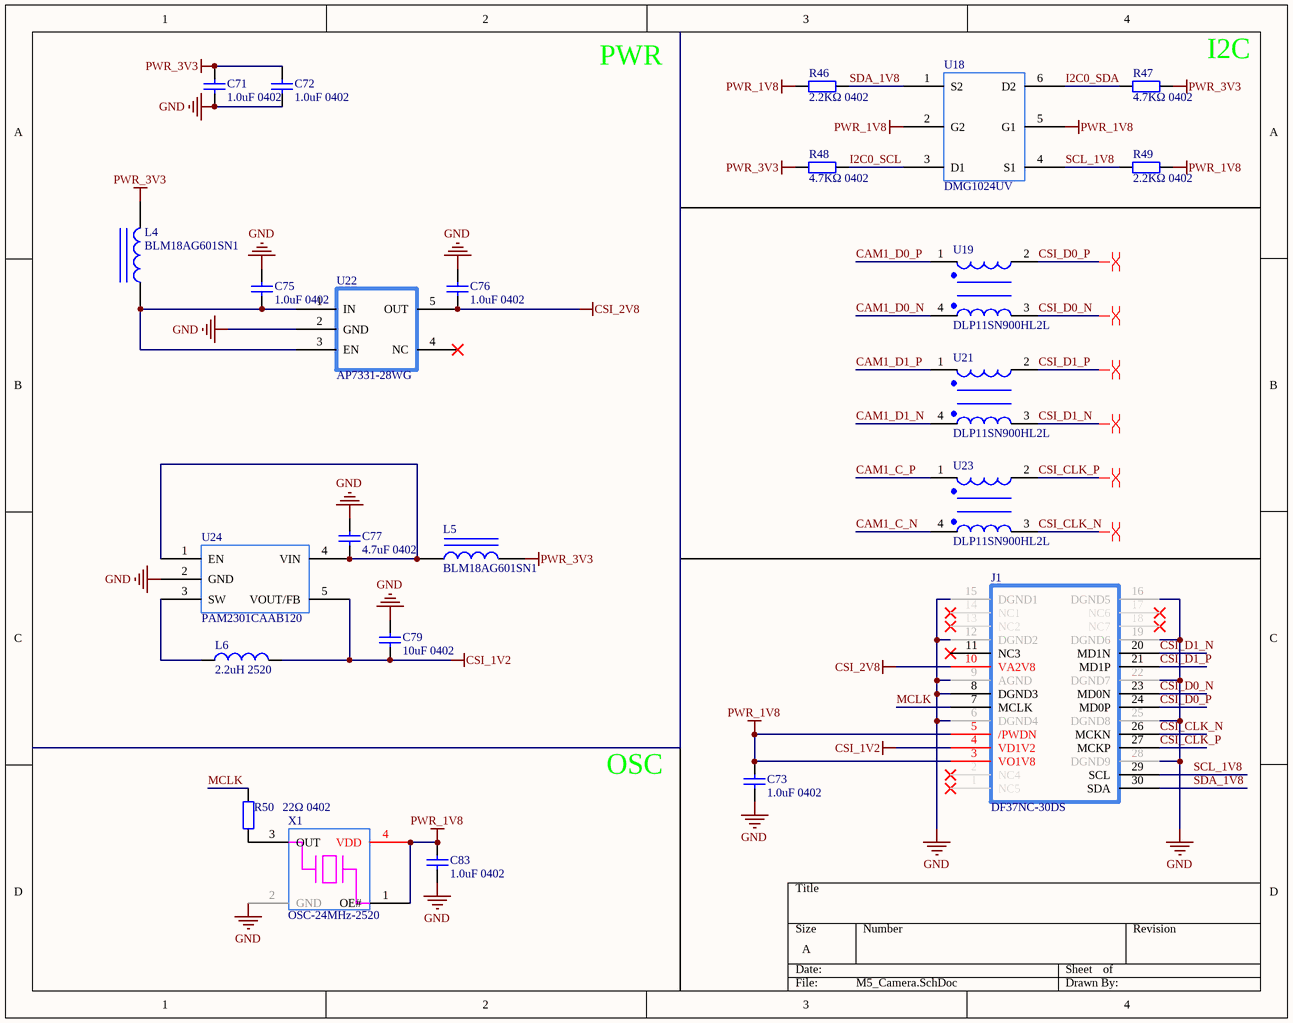
[diagram p4: M5_Camera.SchDoc]

### Parts
C71  1.0uF 0402  [0402_C]
C72  1.0uF 0402  [0402_C]
C73  1.0uF 0402  [0402_C]
C75  1.0uF 0402  [0402_C]
C76  1.0uF 0402  [0402_C]
C77  4.7uF 0402  [0402_C]
C79  10uF 0402  [0402_C]
C83  1.0uF 0402  [0402_C]
J1  DF37NC-30DS  [DF37NF-30DS]
L4  BLM18AG601SN1  [0603_L]
L5  BLM18AG601SN1  [0603_L]
L6  2.2uH 2520  [2.2uH 2520]
R46  2.2KΩ 0402  [0402_R]
R47  4.7KΩ 0402  [0402_R]
R48  4.7KΩ 0402  [0402_R]
R49  2.2KΩ 0402  [0402_R]
R50  22Ω 0402  [0402_R]
U18  DMG1024UV  [DMG1024UV]
U19  DLP11SN900HL2L  [DLP11SN900HL2L]
U21  DLP11SN900HL2L  [DLP11SN900HL2L]
U22  AP7331-28WG  [AP7331-28WG]
U23  DLP11SN900HL2L  [DLP11SN900HL2L]
U24  PAM2301CAAB120  [PAM2301CAAB120]
X1  OSC-24MHz-2520  [OSC-24MHz-2520]

### Nets
CSI_1V2: C79.2 J1.4(VD1V2) L6.2 U24.5(VOUT/FB)
CSI_2V8: C76.1 J1.10(VA2V8) U22.5(OUT)
GND: C71.1 C72.1 C73.1 C75.2 C76.2 C77.2 C79.1 C83.1 J1.6(DGND4) J1.8(DGND3) J1.9(AGND) J1.12(DGND2) J1.15(DGND1) J1.16(DGND5) J1.19(DGND6) J1.22(DGND7) J1.25(DGND8) J1.28(DGND9) U22.2(GND) U24.2(GND) X1.2(GND)
PWR_1V8: C73.2 C83.2 J1.3(VO1V8) J1.5(/PWDN) R46.1 R49.2 U18.2(G2) U18.5(G1) X1.1(OE#) X1.4(VDD)
PWR_3V3: C71.2 C72.2 L4.2 L5.2 R47.2 R48.1
CAM1_C_N: U23.4
CAM1_C_P: U23.1
CAM1_D0_N: U19.4
CAM1_D0_P: U19.1
CAM1_D1_N: U21.4
CAM1_D1_P: U21.1
CSI_CLK_N: J1.26(MCKN) U23.3
CSI_CLK_P: J1.27(MCKP) U23.2
CSI_D0_N: J1.23(MD0N) U19.3
CSI_D0_P: J1.24(MD0P) U19.2
CSI_D1_N: J1.20(MD1N) U21.3
CSI_D1_P: J1.21(MD1P) U21.2
I2C0_SCL: R48.2 U18.3(D1)
I2C0_SDA: R47.1 U18.6(D2)
MCLK: J1.7(MCLK) R50.1
SCL_1V8: J1.29(SCL) R49.1 U18.4(S1)
SDA_1V8: J1.30(SDA) R46.2 U18.1(S2)
NetC75_1: C75.1 L4.1 U22.1(IN) U22.3(EN)
NetC77_1: C77.1 L5.1 U24.1(EN) U24.4(VIN)
NetL6_1: L6.1 U24.3(SW)
NetR50_2: R50.2 X1.3(OUT)

Not connected (* = marked no-connect by the designer): J1 1(NC5)* 2(NC4)* 11(NC3)* 13(NC2)* 14(NC1)* 17(NC6)* 18(NC7)*; U22 4(NC)*

### Layout directives
differential pair: CSI_CLK_N, CSI_CLK_P, CSI_D0_N, CSI_D0_P, CSI_D1_N, CSI_D1_P

### Notes on the sheet
- PWR
- (near R47) I2C
- OSC

### Library data of the parts
C71-C73 C75 C76 C83 = 0402 1.0uF (105) 10% 25V: 贴片电容; ComponentLink1Description: 供应商链接; ComponentLink1URL: http://www.szlcsc.com/product/details_53938.html; Package: 0402; Supplier: LC; SuppliersPartNumber: C52923
C77 = 0402 4.7uF (475) 20% 10V: 贴片电容; ComponentLink1Description: 供应商链接; ComponentLink1URL: http://www.szlcsc.com/product/details_24469.html; Package: 0402; Supplier: LC; SuppliersPartNumber: C23733
C79 = 0402 10uF (106) 20% 6.3V: 贴片电容; ComponentLink1Description: 供应商链接; ComponentLink1URL: http://www.szlcsc.com/product/details_16204.html; Package: 0402; Supplier: LC; SuppliersPartNumber: C15525
J1 = DF37NC-30DS: Camera Connector
L4 L5 = 0603 10uH 10%: 贴片电感; ComponentLink1Description: 供应商链接; ComponentLink1URL: http://www.szlcsc.com/product/details_1387.html; Package: 0603; Supplier: LC; SuppliersPartNumber: C1035
L6 = 2.2uH 2520: 2520; MP: DFE252008U-2R2M=P2; Package: None; Price: None; Value: *; Availability: Unavailable
R46 R49 = 0402 2.2KΩ (2201) 1%: 贴片电阻; ComponentLink1Description: 供应商链接; ComponentLink1URL: http://www.szlcsc.com/product/details_26622.html; Package: 0402; Supplier: LC; SuppliersPartNumber: C25879
R47 R48 = 0402 4.7KΩ (4701) 1%: 贴片电阻; ComponentLink1Description: 供应商链接; ComponentLink1URL: http://www.szlcsc.com/product/details_26643.html; Package: 0402; Supplier: LC; SuppliersPartNumber: C25900
R50 = 0402 22Ω (22R0) 1%: 贴片电阻; ComponentLink1Description: 供应商链接; ComponentLink1URL: http://www.szlcsc.com/product/details_25835.html; Package: 0402; Supplier: LC; SuppliersPartNumber: C25092
U18 = DMG1024UV: Camera
U19 U21 U23 = DLP11SN900HL2L: Camera
U22 = AP7331-28WG: Camera 2.8V
U24 = PAM2301CAAB120: Camera 1.2V
X1 = OSC-24MHz-2520: 24MHz Camera

## Nets that join several sheets
GND: M1_CM4 (51 pins), M2_Power (28 pins), M3_Coral (126 pins), M4_Sensors (44 pins), M5_Camera (21 pins)
PWR_1V05: M2_Power (5 pins), M3_Coral (16 pins)
PWR_1V8: M2_Power (C82.2 U20.5), M3_Coral (7 pins), M5_Camera (10 pins)
PWR_3V3: M1_CM4 (R1.1 R2.1), M2_Power (12 pins), M3_Coral (44 pins), M4_Sensors (44 pins), M5_Camera (6 pins)
PWR_5V: M1_CM4 (6 pins), M2_Power (10 pins)
CAM1_C_N: M1_CM4 (U1.127), M5_Camera (U23.4)
CAM1_C_P: M1_CM4 (U1.129), M5_Camera (U23.1)
CAM1_D0_N: M1_CM4 (U1.115), M5_Camera (U19.4)
CAM1_D0_P: M1_CM4 (U1.117), M5_Camera (U19.1)
CAM1_D1_N: M1_CM4 (U1.121), M5_Camera (U21.4)
CAM1_D1_P: M1_CM4 (U1.123), M5_Camera (U21.1)
I2C0_SCL: M1_CM4 (U1.80), M5_Camera (R48.2 U18.3)
I2C0_SDA: M1_CM4 (U1.82), M5_Camera (R47.1 U18.6)
I2C1_SCL: M1_CM4 (U1.56), M4_Sensors (5 pins)
I2C1_SDA: M1_CM4 (U1.58), M4_Sensors (5 pins)
I2C3_SCL: M1_CM4 (U1.34), M4_Sensors (R23.1 U10.10 U17.6)
I2C3_SDA: M1_CM4 (U1.54), M4_Sensors (R25.1 U10.9 U17.4)
I2S_CLK: M1_CM4 (U1.49), M4_Sensors (U11.1)
I2S_DIN: M1_CM4 (U1.27), M4_Sensors (R27.1 U11.2)
I2S_FS: M1_CM4 (U1.26), M4_Sensors (U11.3)
PCIE_CLK_N: M1_CM4 (U1.112), M3_Coral (U6.22)
PCIE_CLK_P: M1_CM4 (U1.110), M3_Coral (U6.21)
PCIE_REQ: M1_CM4 (U1.102), M3_Coral (R16.1 U6.30)
PCIE_RST: M1_CM4 (U1.109), M3_Coral (C38.2 U6.19)
PCIE_RX_N: M1_CM4 (U1.118), M3_Coral (C36.2)
PCIE_RX_P: M1_CM4 (U1.116), M3_Coral (C37.2)
PCIE_TX_N: M1_CM4 (U1.124), M3_Coral (U6.28)
PCIE_TX_P: M1_CM4 (U1.122), M3_Coral (U6.27)